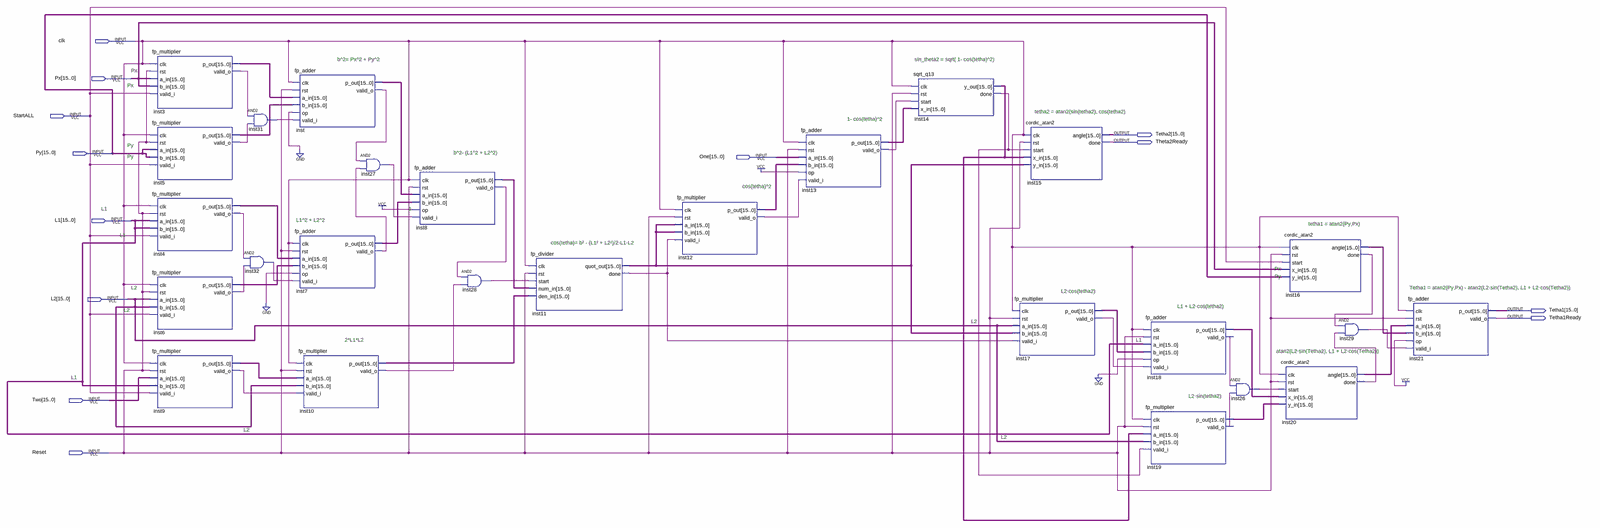
[diagram p0: schematic sheet, whole]
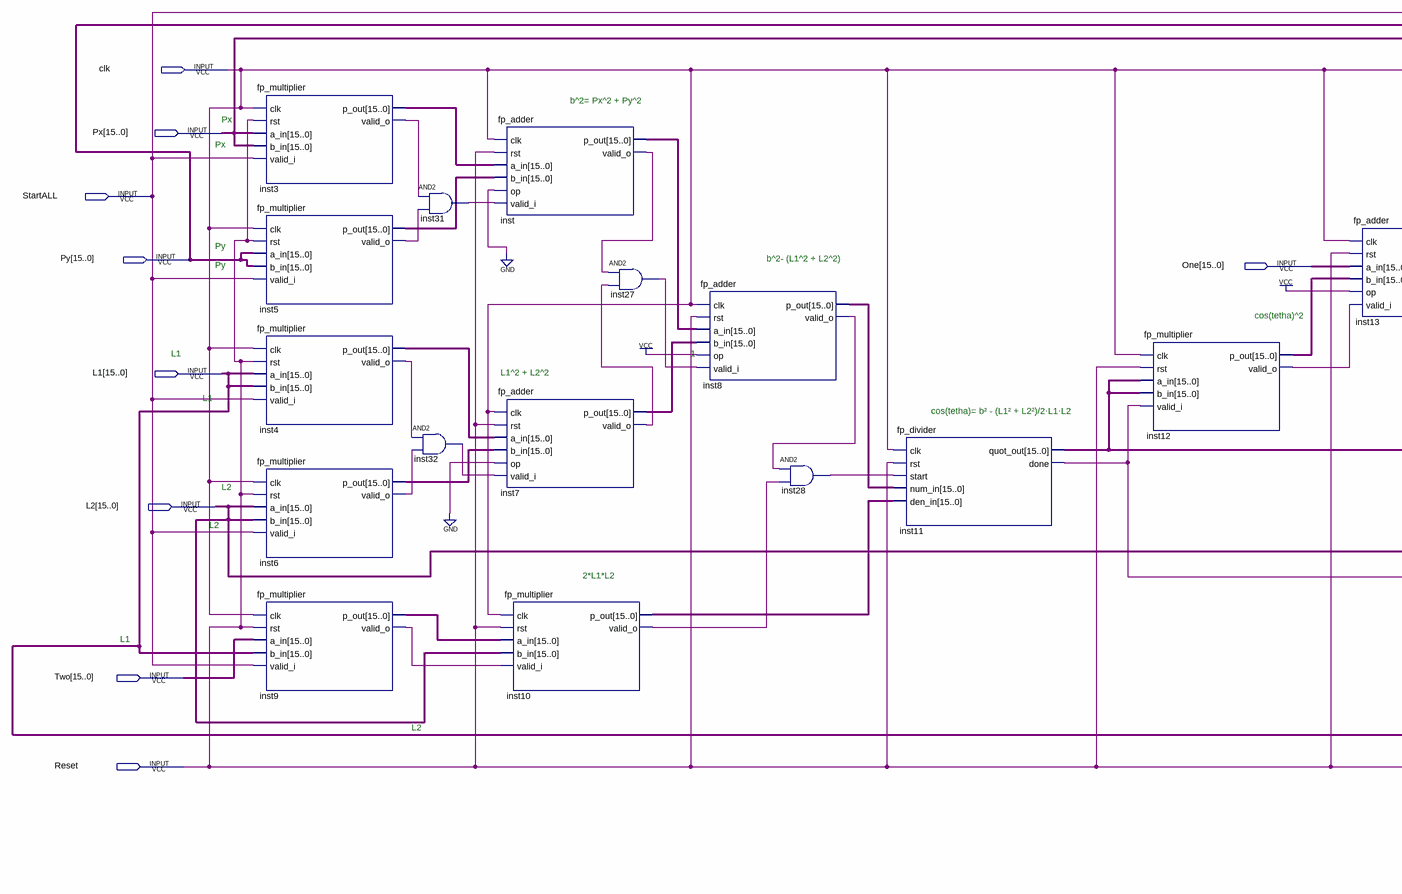
[diagram p1: schematic sheet, left part]
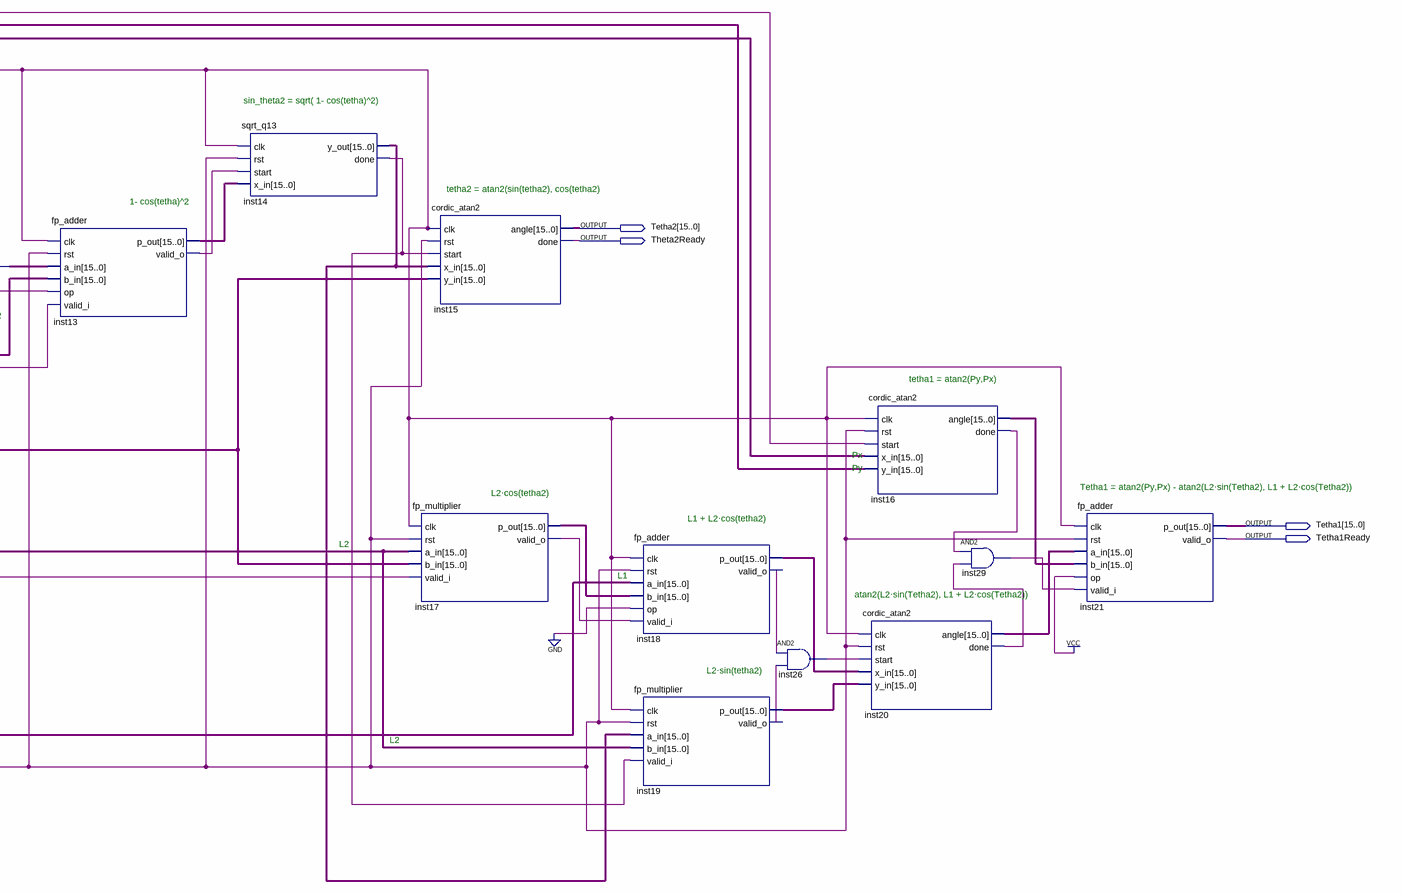
[diagram p2: schematic sheet, right part]
// Quartus schematic Block2R.bdf as structural Verilog: 26 symbols, 13 pins
module Block2R (
  input  clk,
  input  [15:0] Px,
  input  StartALL,
  input  [15:0] Py,
  input  [15:0] One,
  input  [15:0] L1,
  input  [15:0] L2,
  input  [15:0] Two,
  input  Reset,
  output [15:0] Tetha2,
  output Theta2Ready,
  output [15:0] Tetha1,
  output Tetha1Ready
);

  wire inst3_valid_o, inst4_valid_o, inst5_valid_o, inst6_valid_o, inst7_valid_o, inst8_valid_o,
       inst9_valid_o, inst10_valid_o, inst11_done, inst12_valid_o, inst13_valid_o, inst14_done, inst16_done,
       inst17_valid_o, inst18_valid_o, inst19_valid_o, inst20_done, inst26_out, inst27_out, inst28_out,
       inst29_out, inst31_out, inst32_out, inst_valid_o;
  wire [15:0] inst3_p_out, inst4_p_out, inst5_p_out, inst6_p_out, inst7_p_out, inst8_p_out, inst9_p_out,
       inst10_p_out, inst11_quot_out, inst12_p_out, inst13_p_out, inst14_y_out, inst16_angle, inst17_p_out,
       inst18_p_out, inst19_p_out, inst20_angle, inst_p_out;

  fp_multiplier inst3 (
    .clk(clk), .rst(Reset), .a_in(Px), .b_in(Px), .valid_i(StartALL), .p_out(inst3_p_out),
    .valid_o(inst3_valid_o));
  fp_multiplier inst5 (
    .clk(clk), .rst(Reset), .a_in(Py), .b_in(Py), .valid_i(StartALL), .p_out(inst5_p_out),
    .valid_o(inst5_valid_o));
  fp_multiplier inst4 (
    .clk(clk), .rst(Reset), .a_in(L1), .b_in(L1), .valid_i(StartALL), .p_out(inst4_p_out),
    .valid_o(inst4_valid_o));
  fp_multiplier inst6 (
    .clk(clk), .rst(Reset), .a_in(L2), .b_in(L2), .valid_i(StartALL), .p_out(inst6_p_out),
    .valid_o(inst6_valid_o));
  fp_multiplier inst9 (
    .clk(clk), .rst(Reset), .a_in(Two), .b_in(L1), .valid_i(StartALL), .p_out(inst9_p_out),
    .valid_o(inst9_valid_o));
  and inst31 (inst31_out, inst3_valid_o, inst5_valid_o);
  and inst32 (inst32_out, inst4_valid_o, inst6_valid_o);
  fp_adder inst (
    .clk(clk), .rst(Reset), .a_in(inst3_p_out), .b_in(inst5_p_out), .op(1'b0), .valid_i(inst31_out),
    .p_out(inst_p_out), .valid_o(inst_valid_o));
  fp_adder inst7 (
    .clk(clk), .rst(Reset), .a_in(inst4_p_out), .b_in(inst6_p_out), .op(1'b0), .valid_i(inst32_out),
    .p_out(inst7_p_out), .valid_o(inst7_valid_o));
  fp_multiplier inst10 (
    .clk(clk), .rst(Reset), .a_in(inst9_p_out), .b_in(L2), .valid_i(inst9_valid_o), .p_out(inst10_p_out),
    .valid_o(inst10_valid_o));
  and inst27 (inst27_out, inst_valid_o, inst7_valid_o);
  fp_adder inst8 (
    .clk(clk), .rst(Reset), .a_in(inst_p_out), .b_in(inst7_p_out), .op(1'b1), .valid_i(inst27_out),
    .p_out(inst8_p_out), .valid_o(inst8_valid_o));
  and inst28 (inst28_out, inst8_valid_o, inst10_valid_o);
  fp_divider inst11 (
    .clk(clk), .rst(Reset), .start(inst28_out), .num_in(inst8_p_out), .den_in(inst10_p_out),
    .quot_out(inst11_quot_out), .done(inst11_done));
  fp_multiplier inst12 (
    .clk(clk), .rst(Reset), .a_in(inst11_quot_out), .b_in(inst11_quot_out), .valid_i(inst11_done),
    .p_out(inst12_p_out), .valid_o(inst12_valid_o));
  fp_adder inst13 (
    .clk(clk), .rst(Reset), .a_in(One), .b_in(inst12_p_out), .op(1'b1), .valid_i(inst12_valid_o),
    .p_out(inst13_p_out), .valid_o(inst13_valid_o));
  sqrt_q13 inst14 (
    .clk(clk), .rst(Reset), .start(inst13_valid_o), .x_in(inst13_p_out), .y_out(inst14_y_out),
    .done(inst14_done));
  cordic_atan2 inst15 (
    .clk(clk), .rst(Reset), .start(inst14_done), .x_in(inst14_y_out), .y_in(inst11_quot_out), .angle(Tetha2),
    .done(Theta2Ready));
  fp_multiplier inst17 (
    .clk(clk), .rst(Reset), .a_in(L2), .b_in(inst11_quot_out), .valid_i(inst11_done), .p_out(inst17_p_out),
    .valid_o(inst17_valid_o));
  fp_adder inst18 (
    .clk(clk), .rst(Reset), .a_in(L1), .b_in(inst17_p_out), .op(1'b0), .valid_i(inst17_valid_o),
    .p_out(inst18_p_out), .valid_o(inst18_valid_o));
  fp_multiplier inst19 (
    .clk(clk), .rst(Reset), .a_in(inst14_y_out), .b_in(L2), .valid_i(inst14_done), .p_out(inst19_p_out),
    .valid_o(inst19_valid_o));
  and inst26 (inst26_out, inst18_valid_o, inst19_valid_o);
  cordic_atan2 inst16 (
    .clk(clk), .rst(Reset), .start(StartALL), .x_in(Px), .y_in(Py), .angle(inst16_angle), .done(inst16_done));
  cordic_atan2 inst20 (
    .clk(clk), .rst(Reset), .start(inst26_out), .x_in(inst18_p_out), .y_in(inst19_p_out),
    .angle(inst20_angle), .done(inst20_done));
  and inst29 (inst29_out, inst16_done, inst20_done);
  fp_adder inst21 (
    .clk(clk), .rst(Reset), .a_in(inst20_angle), .b_in(inst16_angle), .op(1'b1), .valid_i(inst29_out),
    .p_out(Tetha1), .valid_o(Tetha1Ready));

  // Notes on the sheet:
  //   b^2= Px^2 + Py^2
  //   sin_theta2 = sqrt( 1- cos(tetha)^2)
  //   Px
  //   Px
  //   tetha2 = atan2(sin(tetha2), cos(tetha2)
  //   1- cos(tetha)^2
  //   Py
  //   b^2- (L1^2 + L2^2)
  //   Py
  //   cos(tetha)^2
  //   L1
  //   1
  //   L1^2 + L2^2
  //   tetha1 = atan2(Py,Px)
  //   L1
  //   cos(tetha)= b² - (L1² + L2²)/2·L1·L2
  //   Px
  //   Py
  //   L2
  //   Tetha1 = atan2(Py,Px) - atan2(L2·sin(Tetha2), L1 + L2·cos(Tetha2))
  //   L2·cos(tetha2)
  //   L1 + L2·cos(tetha2)
  //   L2
  //   L2
  //   2*L1*L2
  //   L1
  //    atan2(L2·sin(Tetha2), L1 + L2·cos(Tetha2))
  //   L1
  //   L2·sin(tetha2)
  //   L2
  //   L2
endmodule
